# EAGLE design SparkFun_ACS723_Breakout_v01 (EAGLE 7.1.0)
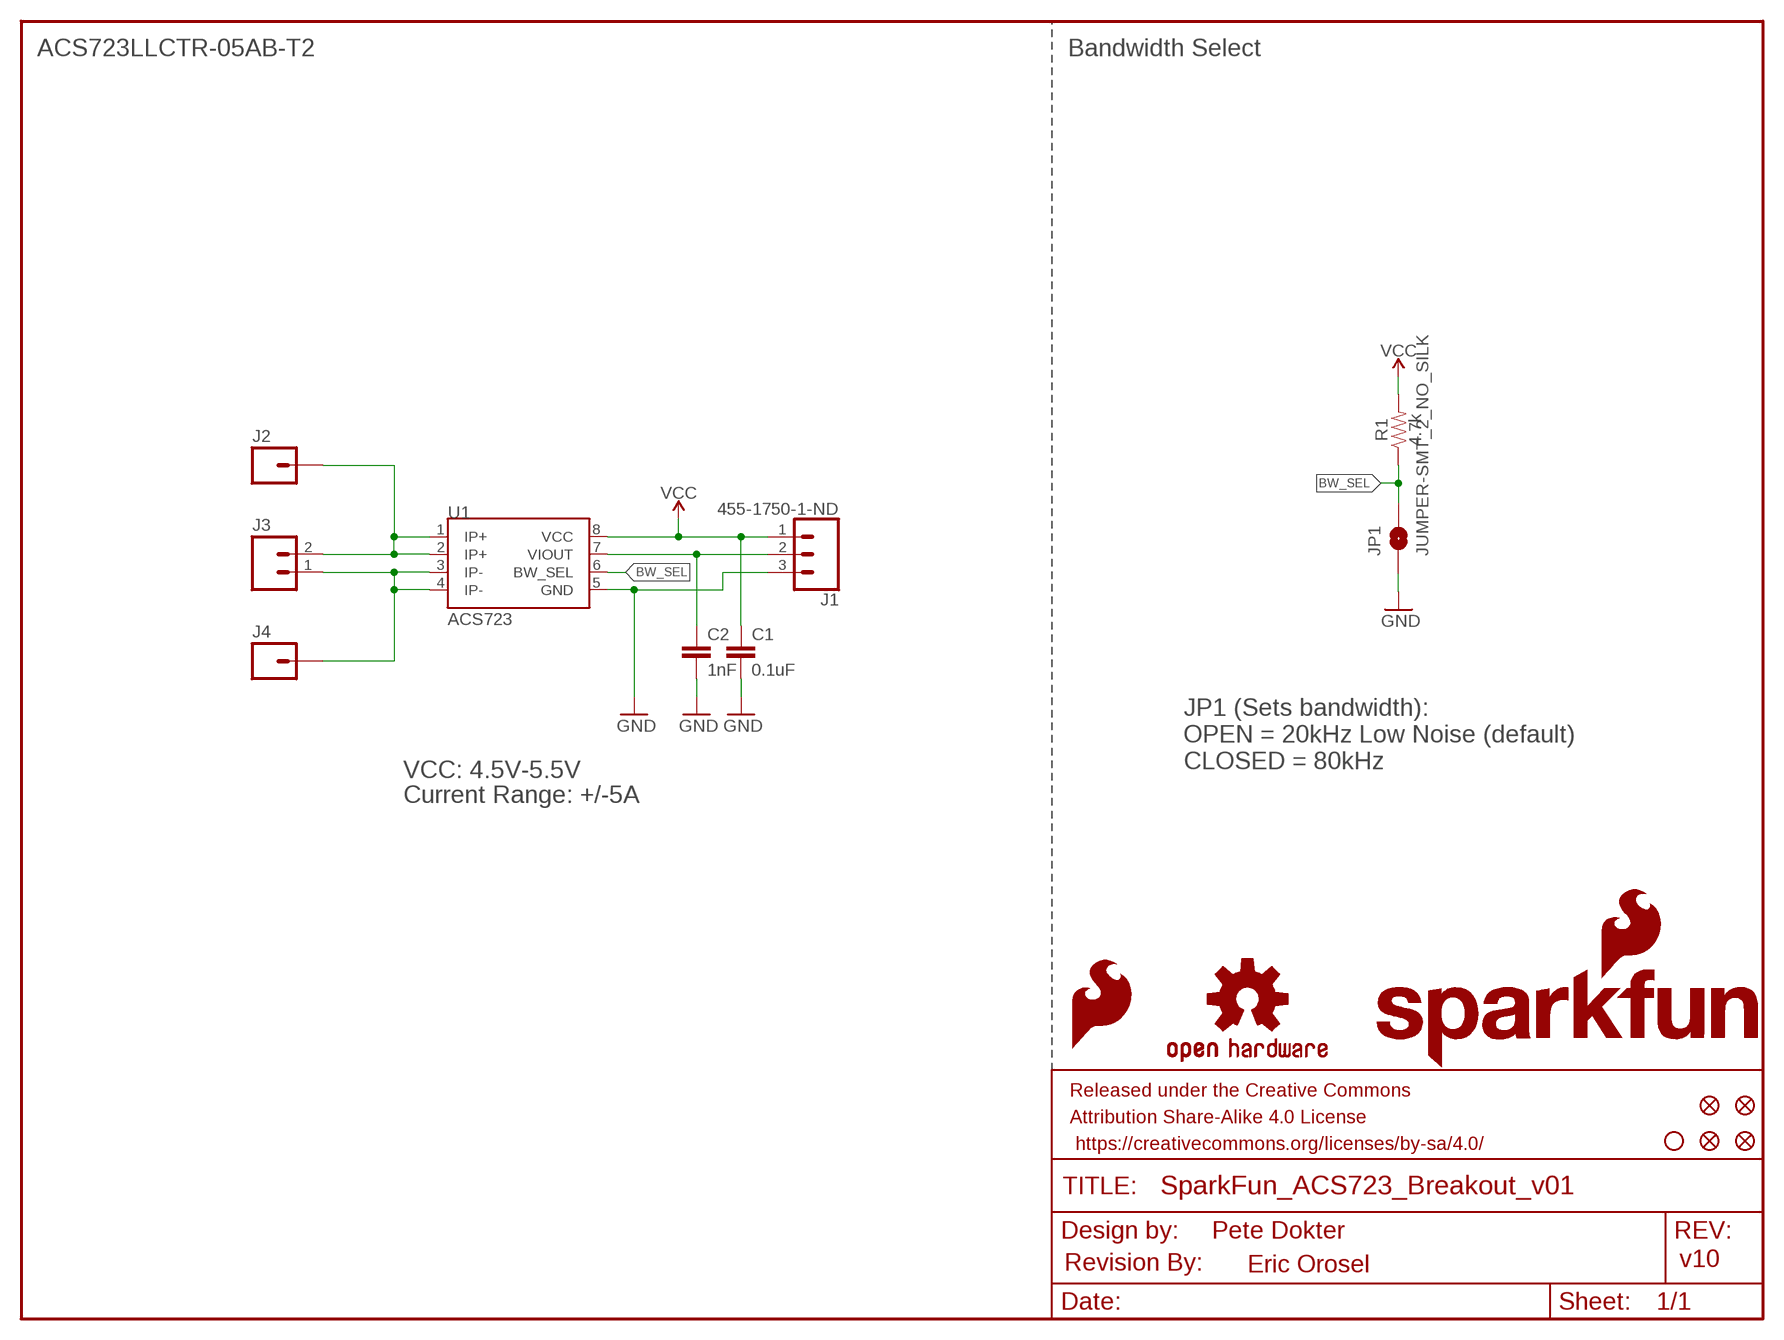
[diagram p0: schematic, sheet 1]

## Parts
C1  0.1uF  0.1UF-0603-25V-(+80/-20%)  [0603]
C2  1nF  1.0NF/1000PF-0603-50V-10%  [0603]
FD2  FIDUCIAL1X2  [FIDUCIAL-1X2]
FD3  FIDUCIAL1X2  [FIDUCIAL-1X2]
FD4  FIDUCIAL1X2  [FIDUCIAL-1X2]
FD5  FIDUCIAL1X2  [FIDUCIAL-1X2]
FRAME1  FRAME-LETTER  [CREATIVE_COMMONS]
J1  455-1750-1-ND  CONN_03  [1X03]
J2  M01-SMTSO-256-ET  [SMTSO-256-ET]
J3  M021X02_NO_SILK  [1X02_NO_SILK@1]
J4  M01-SMTSO-256-ET  [SMTSO-256-ET]
JP1  JUMPER-SMT_2_NO_SILK  [SMT-JUMPER_2_NO_SILK]
JP3  STAND-OFFTIGHT  [STAND-OFF-TIGHT]
LOGO1  SFE_LOGO_FLAME.1_INCH  [SFE_LOGO_FLAME_.1]
LOGO3  SFE_LOGO_NAME_FLAME.1_INCH  [SFE_LOGO_NAME_FLAME_.1]
LOGO4  OSHW-LOGOM  [OSHW-LOGO-M]
R1  4.7k  4.7KOHM-0603-1/10W-1%  [0603]
U1  ACS723  [SO08]
U$1  REVISION  [REVISION]

## Nets
BW_SEL [12_mil]: JP1.2 R1.1 U1.6(BW_SEL)
GND [12_mil]: C1.2 C2.2 J1.3 JP1.1 U1.5(GND)
IP+: J2.P$1 J3.2 U1.1(IP+) U1.2(IP+)
IP-: J3.1 J4.P$1 U1.3(IP-) U1.4(IP-)
N$1 [12_mil]: C2.1 J1.2 U1.7(VIOUT)
VCC [12_mil]: C1.1 J1.1 R1.2 U1.8(VCC)

## Notes on the sheet
- ACS723LLCTR-05AB-T2 | Bandwidth Select
- JP1 (Sets bandwidth):
- OPEN = 20kHz Low Noise (default)
- CLOSED = 80kHz
- VCC: 4.5V-5.5V
- Current Range: +/-5A
- Pete Dokter
- Eric Orosel | v10

## Library data of the parts
C1 = SparkFun-Capacitors:0.1UF: 0.1µF ceramic capacitors A capacitor is a passive two-terminal electrical component used to store electrical energy temporarily in an electric field.; PROD_ID: CAP-00810
C2 = SparkFun-Capacitors:1.0NF/1000PF: 1nF/1,000pF ceramic capacitors A capacitor is a passive two-terminal electrical component used to store electrical energy temporarily in an electric field.; PROD_ID: CAP-07886
FD2-FD5 = SparkFun-Aesthetics:FIDUCIAL: Fiducial Alignment Points Point-of-reference for pick-and-place machines and other optical instruments.
FRAME1 = SparkFun-Aesthetics:FRAME-LETTER: Schematic Frame - Letter Standard 8.5x11 US Letter frame
J1 = SparkFun-Connectors:CONN_03: Multi connection point. Often used as Generic Header-pin footprint for 0.1 inch spaced/style header connections On any of the 0.1 inch spaced packages, you can populate with these: Break Away Headers - Straight <https://www.sparkfun.com/products/116> (PRT-00116) Break Away Male Headers - Right Angle <https://www.sparkfun.com/products/553> (PRT-00553) Female Headers <https://www.sparkfun.com/products/115> (PRT-00115) Break Away Headers - Machine Pin <https://www.sparkfun.com/products/117> (PRT-00117) Break Away Female Headers - Swiss Machine Pin <https://www.sparkfun.com/products/743> (PRT-00743) Stackable Header - 3 Pin (Female, 0.1") <https://www.sparkfun.com/products/13875> (PRT-13875) For SCREWTERMINALS and SPRING TERMINALS visit here: Screw Terimnals on SparkFun.com <https://www.sparkfun.com/search/results?term=Screw+Terminals> (5mm/3.5mm/2.54mm spacing) This device is also useful as a general connection point to wire up your design to another part of your project. Our various solder wires solder well into these plated through hole pads. Hook-Up Wire - Assortment (Stranded, 22 AWG) <https://www.sparkfun.com/products/11375> (PRT-11375) Hook-Up Wire - Assortment (Solid Core, 22 AWG) <https://www.sparkfun.com/products/11367> (PRT-11367) View the entire wire category on our website here <https://www.sparkfun.com/categories/141> Special notes: Molex polarized connector foot print use with SKU : PRT-08232 with associated crimp pins and housings.; PROD_ID: XXX-00000
J2 J4 = SparkFun-Connectors:M01: Header 1 Standard 1-pin 0.1" header. Use with straight break away headers (SKU : PRT-00116), right angle break away headers (PRT-00553), swiss pins (PRT-00743), machine pins (PRT-00117), and female headers (PRT-00115).
J3 = SparkFun-Connectors:M02: Standard 2-pin 0.1" header. Use with - straight break away headers ( PRT-00116) - right angle break away headers (PRT-00553) - swiss pins (PRT-00743) - machine pins (PRT-00117) - female headers (PRT-00115) Molex polarized connector foot print use with: PRT-08233 with associated crimp pins and housings. 2.54_SCREWTERM for use with PRT-10571. 3.5mm Screw Terminal footprints for PRT-08084 5mm Screw Terminal footprints for use with PRT-08432
JP1 = SparkFun-Jumpers:JUMPER-SMT_2_NO: Normally open jumper This jumper has two pads in close proximity to each other. Apply solder to close the connection. Round pads are easier to solder for beginners, but are a lot larger. SparkFun Product that uses the round pads: SparkFun EL Sequencer <https://www.sparkfun.com/products/12781>
JP3 = SparkFun-Hardware:STAND-OFF: Stand Off Drill holes for mechanically mounting via screws, standoffs, etc. Note: Use the keepout ring to avoid running the screw head into surrounding components. Variant Overviews STAND-OFF - Mechanical footprint for a #4 phillips button head screw. STAND-OFF-TIGHT - Mechanical footprint for a #4 phillips button head screw, Example SparkFun Products Screw - Phillips Head (1/4", 4-40, 10 pack) <https://www.sparkfun.com/products/10453> (PRT-10453) Screw - Phillips Head (1/2", 4-40, 10 pack) <https://www.sparkfun.com/products/10452> (PRT-10452) Screw - Phillips Head (3/4", 4-40, 10 pack) <https://www.sparkfun.com/products/10451> (PRT-10451) Screw - Phillips Head (1", 4-40, 10 pack) <https://www.sparkfun.com/products/10450> (PRT-10450)
LOGO1 = SparkFun-Aesthetics:SFE_LOGO_FLAME: SparkFun Flame Logo This is the SparkFun flame logo. The logo on the schematic will always be the same size; the package variant is the height of the flame. Default layer for the logo on the board is tSilk.
LOGO3 = SparkFun-Aesthetics:SFE_LOGO_NAME_FLAME: SparkFun Font Logo w/ Flame This is the SparkFun full logo. The logo on the schematic will always be the same size; the package variant is the height of the flame part of the logo. Default layer for the logo on the board is tSilk.
LOGO4 = SparkFun-Aesthetics:OSHW-LOGO: Open-Source Hardware (OSHW) Logo This logo indicates the piece of hardware it is found on incorporates a OSHW license and/or adheres to the definition of open source hardware found here: http://freedomdefined.org/OSHW
R1 = SparkFun-Resistors:4.7KOHM: 4.7kΩ resistor A resistor is a passive two-terminal electrical component that implements electrical resistance as a circuit element. Resistors act to reduce current flow, and, at the same time, act to lower voltage levels within circuits. - Wikipedia; PROD_ID: RES-07857
U1 = SparkFun-Sensors:ACS723; PART_#: ACS723ACS723LLCTR-05AB-T2; PROD_ID: IC-13872
U$1 = SparkFun-Aesthetics:REVISION: "Revision By" Text Preceding text for revisor documentation. Includes schematic text on "symbols" layer, and board text on tDoc.

## Net classes
1 8_mil: width 0.203 mm
2 10_mil: width 0.254 mm
3 12_mil: width 0.305 mm
4 15_mil: width 0.381 mm
5 20_mil: width 0.508 mm
6 25_mil: width 0.635 mm
7 30_mil: width 0.762 mm

## Board
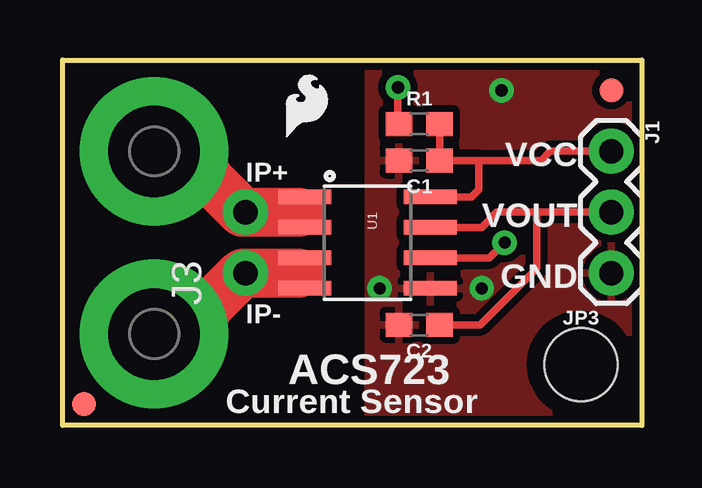
[diagram p1: board, top side]
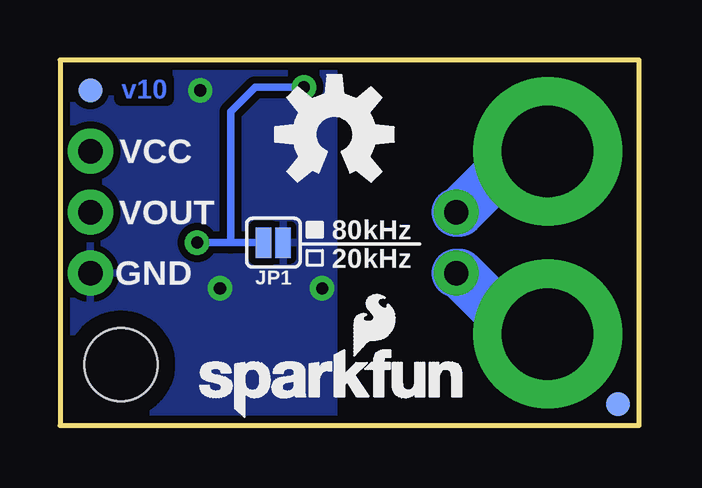
[diagram p2: board, bottom side, seen from below]

Size 24.13 x 15.24 mm. Coordinates in mm from the lower left corner, seen from the top.
Outline: 0,0 0,15.24 24.13,15.24 24.13,0 0,0
Copper layers (1*16): Top 0.035mm / dielectric 1.5mm / Bottom 0.035mm
Design rules "SparkFun-2-layer-STANDARD": minimum track width 10mil, minimum drill 20mil, track to track 10mil, track to pad 8mil, pad to pad 8mil, via to via 10mil, smd to smd 8mil, copper to edge 8mil, drill to drill 8mil, minimum pad ring 10mil, minimum via ring 10mil, stop-mask expansion 4mil, vias tented up to drill 25mil, thermal gap 10mil

### Footprints (pad centres in the part's own frame; a part is rotated, then mirrored left to right if it is on the bottom)
0603 = smd 1.1 x 1: 1 -0.85,0; 2 0.85,0
FIDUCIAL-1X2 = smd 1 x 1: 1 0,0
1X03 = drill 1.016 pad 1.88: 1 0,0; 2 2.54,0; 3 5.08,0
SMTSO-256-ET = drill 3.81 pad 6.198: P$1 0,0
1X02_NO_SILK@1 = drill 1.016 pad 1.88: 1 0,0; 2 2.54,0
SMT-JUMPER_2_NO_SILK = smd 0.635 x 1.27: 1 -0.406,0; 2 0.406,0
STAND-OFF-TIGHT = hole 3.048: 0,0
SO08 = smd 0.61 x 2.21: 1 -1.905,-2.616; 2 -0.635,-2.616; 3 0.635,-2.616; 4 1.905,-2.616; 5 1.905,2.616; 6 0.635,2.616; 7 -0.635,2.616; 8 -1.905,2.616

### Placement (x,y rotation side)
C1  14.86,11.05 180 top
C2  14.86,4.19 180 top
FD2  0.89,0.89 0 top
FD3  22.86,13.97 0 bottom
FD4  22.86,13.97 0 top
FD5  0.89,0.89 0 bottom
FRAME1  -16.51,-11.43 0 top  (outside the outline)
J1  22.86,11.43 270 top
J2  3.81,11.43 0 top
J3  7.62,6.35 90 top
J4  3.81,3.81 0 top
JP1  15.24,7.62 180 bottom
JP3  21.59,2.54 0 top
LOGO1  9.02,11.68 0 top
LOGO3  18.73,0.25 0 bottom
LOGO4  12.7,12.13 0 bottom
R1  14.86,12.57 0 top
U1  12.7,7.62 270 top
U$1  -5.08,-13.97 0 top  (outside the outline)

### Tracks (layer width: path | path; a pad name or v marks a point on that pad's centre or on a via)
BW_SEL  (via drill 0.51)
  Top 0.305: U1.6 17.78,6.99 v18.41,7.62 | v13.97,14.1 13.97,12.61 R1.1
  Bottom 0.305: v13.97,14.1 16,14.1 17.02,13.08 17.02,7.62 | 17.02,7.62 v18.41,7.62 | JP1.2 17.02,7.62
GND  (via drill 0.51)
  other vias: 13.21,5.71 18.29,13.97 17.46,5.71
  pour Bottom (isolate 0.305): 12.73,0 24.13,0 24.13,15.24 12.73,15.24
  pour Top (isolate 0.305): 12.73,0 24.13,0 24.13,15.24 12.73,15.24
IP+
  Top 0.305: 10.21,8.52 10.21,8.38 U1.2 | 10.21,9.26 10.21,9.4 U1.1
  Top 0.762: 10.21,8.52 9.84,8.89 10.21,9.26
  Top 1.778: 7.49,8.89 J3.2
  Top 2.032: J2.P$1 4.95,11.43 7.49,8.89 | J3.2 9.84,8.89
  Bottom 2.032: J2.P$1 4.95,11.43 7.49,8.89 J3.2
IP-
  Top 0.305: 10.21,5.98 10.21,5.84 U1.4 | 10.21,6.72 10.21,6.86 U1.3
  Top 0.762: 10.21,6.72 9.84,6.35 10.21,5.98
  Top 1.778: 7.49,6.35 J3.1
  Top 2.032: J4.P$1 4.95,3.81 7.49,6.35 | J3.1 9.84,6.35
  Bottom 2.032: J4.P$1 4.95,3.81 7.49,6.35 J3.1
N$1
  Top 0.305: C2.1 17.4,4.19 19.75,6.54 19.75,8.89 | 19.75,8.89 J1.2 | U1.7 17.46,8.26 18.1,8.89 19.75,8.89
VCC
  Top 0.305: R1.2 C1.1 17.34,11.05 | U1.8 17.02,9.53 17.34,9.84 17.34,11.05 | J1.1 20.32,11.43 19.94,11.05 17.34,11.05

### Text on the board
Bottom: v10
tPlace: VCC | IP+ | VOUT | GND | IP- | ACS723 | Current Sensor
bPlace: VCC | VOUT | 80kHz | 20kHz | GND
tDocu: Pete Dokter | Eric Orosel